# Altium project F407.PrjPCB
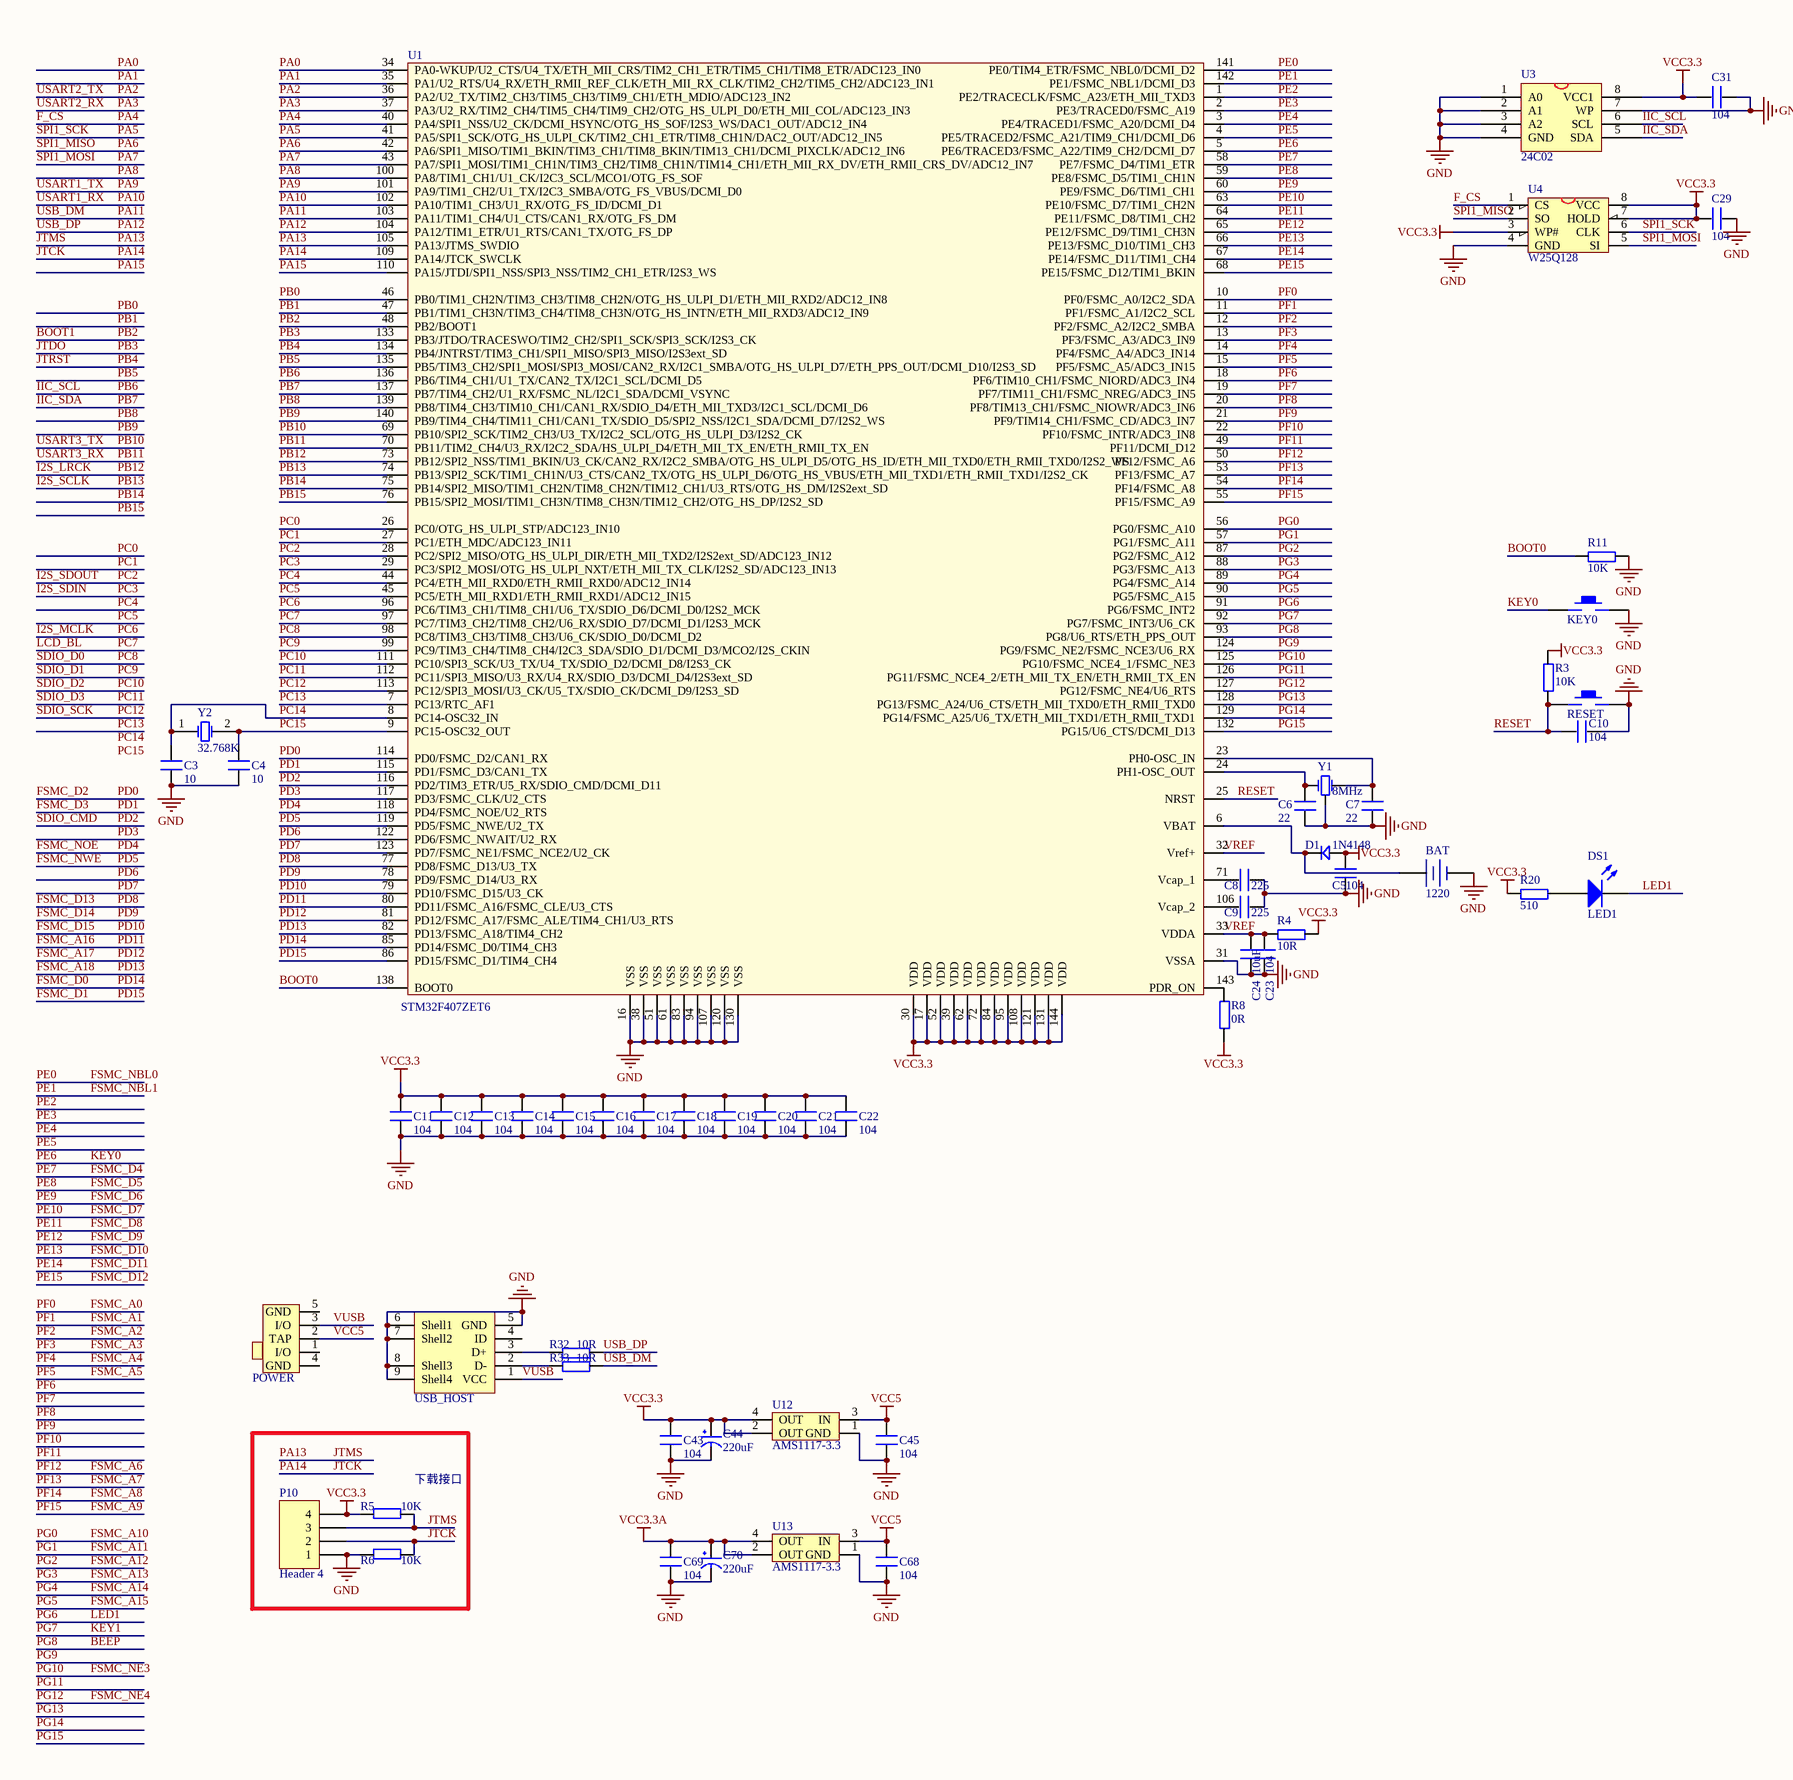
[diagram p0: F407.SchDoc, left]
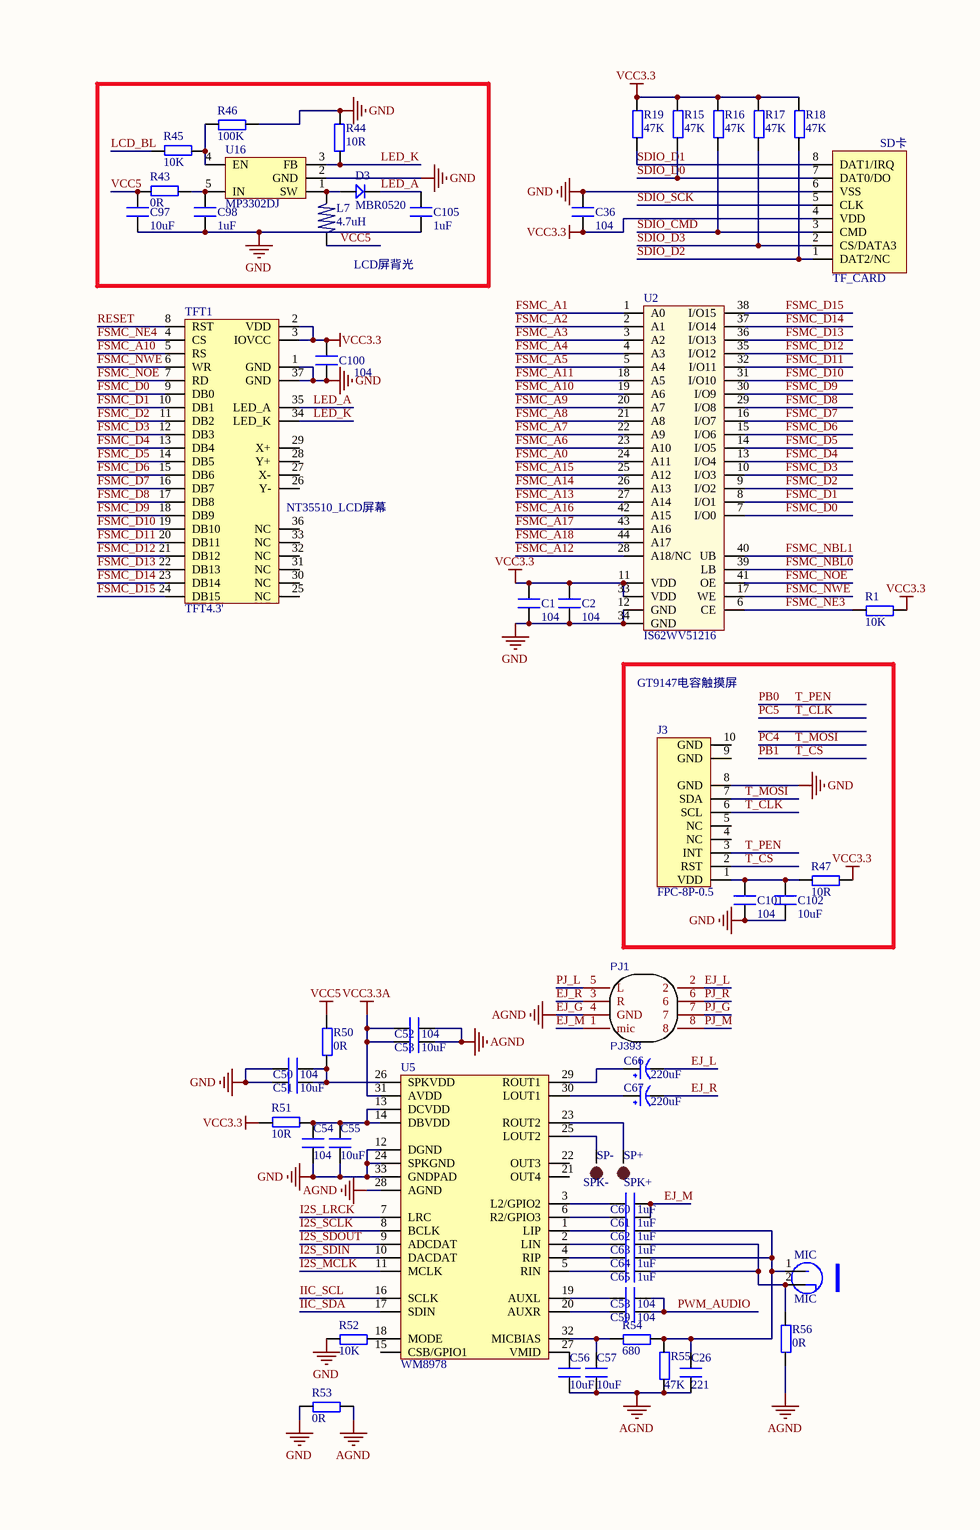
[diagram p1: F407.SchDoc, right]
1 sheet, 112 parts. Net scope: global (net labels, ports and power ports of the same name join across sheets).
Board file: F407.PcbDoc

## Sheet F407.SchDoc
size A2

### Parts
BAT  1220  [CR1220_B]
C1  104  [C 0603_M]
C2  104  [C 0603_M]
C3  10  [C 0603_M]
C4  10  [C 0603_M]
C5  104  [C 0603_M]
C6  22  [C 0603_M]
C7  22  [C 0603_M]
C8  225  [C 0603_M]
C9  225  [C 0603_M]
C10  104  [C 0603_M]
C11  104  [C 0603_M]
C12  104  [C 0603_M]
C13  104  [C 0603_M]
C14  104  [C 0603_M]
C15  104  [C 0603_M]
C16  104  [C 0603_M]
C17  104  [C 0603_M]
C18  104  [C 0603_M]
C19  104  [C 0603_M]
C20  104  [C 0603_M]
C21  104  [C 0603_M]
C22  104  [C 0603_M]
C23  104  [C 0603_M]
C24  10uF  [C 0603_M]
C26  221  [C 0603_M]
C29  104  [C 0603_M]
C31  104  [C 0603_M]
C36  104  [C 0603_M]
C43  104  [C 0603_M]
C44  220uF  [CT 6*6 - C]
C45  104  [C 0603_M]
C50  104  [C 0603_M]
C51  10uF  [C 0603_M]
C52  104  [C 0603_M]
C53  10uF  [C 0603_M]
C54  104  [C 0603_M]
C55  10uF  [C 0603_M]
C56  10uF  [C 0603_M]
C57  10uF  [C 0603_M]
C58  104  [C 0603_M]
C59  104  [C 0603_M]
C60  1uF  [C 0603_M]
C61  1uF  [C 0603_M]
C62  1uF  [C 0603_M]
C63  1uF  [C 0603_M]
C64  1uF  [C 0603_M]
C65  1uF  [C 0603_M]
C66  220uF  [CT 6*6 - C]
C67  220uF  [CT 6*6 - C]
C68  104  [C 0603_M]
C69  104  [C 0603_M]
C70  220uF  [CT 6*6 - C]
C97  10uF  [C 0603_M]
C98  1uF  [C 0603_M]
C100  104  [C 0603_M]
C101  104  [C 0603_M]
C102  10uF  [C 0603_M]
C105  1uF  [C 0603_M]
D1  1N4148  [DIODE_SOP]
D3  MBR0520  [SOD-123]
DS1  LED1  [LED 0603R]
J3  FPC-8P-0.5  [FPC-8P]
KEY0  KEY_M  [TSW SMD-3*6*2.5]  (value not drawn)
L7  4.7uH  [L_SOP4]
MIC  MIC  [MIC-6022]
P10  Header 4  [HDR2.54-LI-4P]
PJ1  PJ393  [PJ393]
POWER  BUTTON_DIP3  [MSK-12C01-07]  (value not drawn)
R1  10K  [R 0603_M]
R3  10K  [R 0603_M]
R4  10R  [R 0603_M]
R5  10K  [R 0603_M]
R6  10K  [R 0603_M]
R8  0R  [R 0603_M]
R11  10K  [R 0603_M]
R15  47K  [R 0603_M]
R16  47K  [R 0603_M]
R17  47K  [R 0603_M]
R18  47K  [R 0603_M]
R19  47K  [R 0603_M]
R20  510  [R 0603_M]
R32  10R  [R 0603_M]
R33  10R  [R 0603_M]
R43  0R  [R 0603_M]
R44  10R  [R 0603_M]
R45  10K  [R 0603_M]
R46  100K  [R 0603_M]
R47  10R  [R 0603_M]
R50  0R  [R 0603_M]
R51  10R  [R 0603_M]
R52  10K  [R 0603_M]
R53  0R  [R 0603_M]
R54  680  [R 0603_M]
R55  47K  [R 0603_M]
R56  0R  [R 0603_M]
RESET  KEY_M  [TSW SMD-3*6*2.5]  (value not drawn)
SP+  SPK+  [TP-1.5]
SP-  SPK-  [TP-1.5]
TF_CARD  SD-MICRO-TF  [SD-MICRO-TF]  (value not drawn)
TFT1  TFT4.3'  [TFT4.3']
U1  STM32F407ZET6  [LQFP144]
U2  IS62WV51216  [TSOP44]
U3  24C02  [SOP-8]
U4  W25Q128  [SOIC-8]
U5  WM8978  [qfn32]
U12  AMS1117-3.3  [AMS1117]
U13  AMS1117-3.3  [AMS1117]
U16  MP3302DJ  [SOT-23-5]
USB_HOST  J-MICRO-USB-5S  [USB-AB-5S]  (value not drawn)
Y1  8MHz  [Y-XTAL-3215-3P]
Y2  32.768K  [Y-XTAL-3215-2P]

### Blocks framed on the sheet
LCD屏背光: C97 C98 C105 D3 L7 R43-R46 U16
GT9147电容触摸屏: C101 C102 J3 R47
下载接口: P10 R5 R6

### Nets
EJ_G: C26.1 C52.2 C53.2 C56.1 C57.1 PJ1.4(GND) R53.2 R55.1 R56.1 U5.28(AGND)  [also labelled AGND]
GND: BAT.2(DC-) C1.1 C2.1 C3.1 C4.2 C5.1 C6.1 C7.1 C8.2 C9.2 C10.1 C11.1 C12.1 C13.1 C14.1 C15.1 C16.1 C17.1 C18.1 C19.1 C20.1 C21.1 C22.1 C23.1 C24.1 C29.2 C31.2 C36.2 C43.1 C44.2(GND) C45.1 C50.1 C51.1 C54.1 C55.1 C68.1 C69.1 C70.2(GND) C97.1 C98.1 C100.1 C101.1 C102.1 C105.2 J3.8(GND) KEY0.2 P10.1 R6.2 R11.2 R44.1 R46.2 R52.1 R53.1 RESET.2 TF_CARD.6(VSS) TFT1.1(GND) TFT1.37(GND) U1.16(VSS) U1.31(VSSA) U1.38(VSS) U1.51(VSS) U1.61(VSS) U1.83(VSS) U1.94(VSS) U1.107(VSS) U1.120(VSS) U1.130(VSS) U2.12(GND) U2.34(GND) U3.1(A0) U3.2(A1) U3.3(A2) U3.4(GND) U3.7(WP) U4.4(GND) U5.12(DGND) U5.24(SPKGND) U5.33(GNDPAD) U12.1(GND) U13.1(GND) U16.2(GND) USB_HOST.5(GND) USB_HOST.6(Shell1) USB_HOST.7(Shell2) USB_HOST.8(Shell3) USB_HOST.9(Shell4) Y1.2(GND)
VCC3.3: C1.2 C2.2 C5.2 C11.2 C12.2 C13.2 C14.2 C15.2 C16.2 C17.2 C18.2 C19.2 C20.2 C21.2 C22.2 C29.1 C31.1 C36.1 C43.2 C44.1(VCC) C100.2 D1.1 P10.4 R1.2 R3.2 R4.2 R5.2 R8.1 R15.2 R16.2 R17.2 R18.2 R19.2 R20.1 R47.2 R51.2 TF_CARD.4(VDD) TFT1.2(VDD) TFT1.3(IOVCC) U1.17(VDD) U1.30(VDD) U1.39(VDD) U1.52(VDD) U1.62(VDD) U1.72(VDD) U1.84(VDD) U1.95(VDD) U1.108(VDD) U1.121(VDD) U1.131(VDD) U1.144(VDD) U2.11(VDD) U2.33(VDD) U3.8(VCC1) U4.3(WP#) U4.7(HOLD) U4.8(VCC) U12.2(OUT) U12.4(OUT)
VCC3.3A: C52.1 C53.1 C69.2 C70.1(VCC) U5.31(AVDD) U13.2(OUT) U13.4(OUT)
VCC5: C45.2 C68.2 C97.2 L7.2 POWER.2(TAP) R43.2 R50.2 U12.3(IN) U13.3(IN)
BEEP: U1.93(PG8/U6_RTS/ETH_PPS_OUT)  [also labelled PG8]
BOOT0: R11.1 U1.138(BOOT0)
BOOT1: U1.48(PB2/BOOT1)  [also labelled PB2]
EJ_L: C66.2(GND) PJ1.2
EJ_M: C60.2 C61.2 PJ1.1(mic)
EJ_R: C67.2(GND) PJ1.3(R)
F_CS: U1.40(PA4/SPI1_NSS/U2_CK/DCMI_HSYNC/OTG_HS_SOF/I2S3_WS/DAC1_OUT/ADC12_IN4) U4.1(CS)  [also labelled PA4]
FSMC_A0: U1.10(PF0/FSMC_A0/I2C2_SDA) U2.24(A11)  [also labelled PF0]
FSMC_A1: U1.11(PF1/FSMC_A1/I2C2_SCL) U2.1(A0)  [also labelled PF1]
FSMC_A2: U1.12(PF2/FSMC_A2/I2C2_SMBA) U2.2(A1)  [also labelled PF2]
FSMC_A3: U1.13(PF3/FSMC_A3/ADC3_IN9) U2.3(A2)  [also labelled PF3]
FSMC_A4: U1.14(PF4/FSMC_A4/ADC3_IN14) U2.4(A3)  [also labelled PF4]
FSMC_A5: U1.15(PF5/FSMC_A5/ADC3_IN15) U2.5(A4)  [also labelled PF5]
FSMC_A6: U1.50(PF12/FSMC_A6) U2.23(A10)  [also labelled PF12]
FSMC_A7: U1.53(PF13/FSMC_A7) U2.22(A9)  [also labelled PF13]
FSMC_A8: U1.54(PF14/FSMC_A8) U2.21(A8)  [also labelled PF14]
FSMC_A9: U1.55(PF15/FSMC_A9) U2.20(A7)  [also labelled PF15]
FSMC_A10: TFT1.5(RS) U1.56(PG0/FSMC_A10) U2.19(A6)  [also labelled PG0]
FSMC_A11: U1.57(PG1/FSMC_A11) U2.18(A5)  [also labelled PG1]
FSMC_A12: U1.87(PG2/FSMC_A12) U2.28(A18/NC)  [also labelled PG2]
FSMC_A13: U1.88(PG3/FSMC_A13) U2.27(A14)  [also labelled PG3]
FSMC_A14: U1.89(PG4/FSMC_A14) U2.26(A13)  [also labelled PG4]
FSMC_A15: U1.90(PG5/FSMC_A15) U2.25(A12)  [also labelled PG5]
FSMC_A16: U1.80(PD11/FSMC_A16/FSMC_CLE/U3_CTS) U2.42(A15)  [also labelled PD11]
FSMC_A17: U1.81(PD12/FSMC_A17/FSMC_ALE/TIM4_CH1/U3_RTS) U2.43(A16)  [also labelled PD12]
FSMC_A18: U1.82(PD13/FSMC_A18/TIM4_CH2) U2.44(A17)  [also labelled PD13]
FSMC_D0: TFT1.9(DB0) U1.85(PD14/FSMC_D0/TIM4_CH3) U2.7(I/O0)  [also labelled PD14]
FSMC_D1: TFT1.10(DB1) U1.86(PD15/FSMC_D1/TIM4_CH4) U2.8(I/O1)  [also labelled PD15]
FSMC_D2: TFT1.11(DB2) U1.114(PD0/FSMC_D2/CAN1_RX) U2.9(I/O2)  [also labelled PD0]
FSMC_D3: TFT1.12(DB3) U1.115(PD1/FSMC_D3/CAN1_TX) U2.10(I/O3)  [also labelled PD1]
FSMC_D4: TFT1.13(DB4) U1.58(PE7/FSMC_D4/TIM1_ETR) U2.13(I/O4)  [also labelled PE7]
FSMC_D5: TFT1.14(DB5) U1.59(PE8/FSMC_D5/TIM1_CH1N) U2.14(I/O5)  [also labelled PE8]
FSMC_D6: TFT1.15(DB6) U1.60(PE9/FSMC_D6/TIM1_CH1) U2.15(I/O6)  [also labelled PE9]
FSMC_D7: TFT1.16(DB7) U1.63(PE10/FSMC_D7/TIM1_CH2N) U2.16(I/O7)  [also labelled PE10]
FSMC_D8: TFT1.17(DB8) U1.64(PE11/FSMC_D8/TIM1_CH2) U2.29(I/O8)  [also labelled PE11]
FSMC_D9: TFT1.18(DB9) U1.65(PE12/FSMC_D9/TIM1_CH3N) U2.30(I/O9)  [also labelled PE12]
FSMC_D10: TFT1.19(DB10) U1.66(PE13/FSMC_D10/TIM1_CH3) U2.31(I/O10)  [also labelled PE13]
FSMC_D11: TFT1.20(DB11) U1.67(PE14/FSMC_D11/TIM1_CH4) U2.32(I/O11)  [also labelled PE14]
FSMC_D12: TFT1.21(DB12) U1.68(PE15/FSMC_D12/TIM1_BKIN) U2.35(I/O12)  [also labelled PE15]
FSMC_D13: TFT1.22(DB13) U1.77(PD8/FSMC_D13/U3_TX) U2.36(I/O13)  [also labelled PD8]
FSMC_D14: TFT1.23(DB14) U1.78(PD9/FSMC_D14/U3_RX) U2.37(I/O14)  [also labelled PD9]
FSMC_D15: TFT1.24(DB15) U1.79(PD10/FSMC_D15/U3_CK) U2.38(I/O15)  [also labelled PD10]
FSMC_NBL0: U1.141(PE0/TIM4_ETR/FSMC_NBL0/DCMI_D2) U2.39(LB)  [also labelled PE0]
FSMC_NBL1: U1.142(PE1/FSMC_NBL1/DCMI_D3) U2.40(UB)  [also labelled PE1]
FSMC_NE3: R1.1 U1.125(PG10/FSMC_NCE4_1/FSMC_NE3) U2.6(CE)  [also labelled PG10]
FSMC_NE4: TFT1.4(CS) U1.127(PG12/FSMC_NE4/U6_RTS)  [also labelled PG12]
FSMC_NOE: TFT1.7(RD) U1.118(PD4/FSMC_NOE/U2_RTS) U2.41(OE)  [also labelled PD4]
FSMC_NWE: TFT1.6(WR) U1.119(PD5/FSMC_NWE/U2_TX) U2.17(WE)  [also labelled PD5]
I2S_LRCK: U1.73(PB12/SPI2_NSS/TIM1_BKIN/U3_CK/CAN2_RX/I2C2_SMBA/OTG_HS_ULPI_D5/OTG_HS_ID/ETH_MII_TXD0/ETH_RMII_TXD0/I2S2_WS) U5.7(LRC)  [also labelled PB12]
I2S_MCLK: U1.96(PC6/TIM3_CH1/TIM8_CH1/U6_TX/SDIO_D6/DCMI_D0/I2S2_MCK) U5.11(MCLK)  [also labelled PC6]
I2S_SCLK: U1.74(PB13/SPI2_SCK/TIM1_CH1N/U3_CTS/CAN2_TX/OTG_HS_ULPI_D6/OTG_HS_VBUS/ETH_MII_TXD1/ETH_RMII_TXD1/I2S2_CK) U5.8(BCLK)  [also labelled PB13]
I2S_SDIN: U1.29(PC3/SPI2_MOSI/OTG_HS_ULPI_NXT/ETH_MII_TX_CLK/I2S2_SD/ADC123_IN13) U5.10(DACDAT)  [also labelled PC3]
I2S_SDOUT: U1.28(PC2/SPI2_MISO/OTG_HS_ULPI_DIR/ETH_MII_TXD2/I2S2ext_SD/ADC123_IN12) U5.9(ADCDAT)  [also labelled PC2]
IIC_SCL: U1.136(PB6/TIM4_CH1/U1_TX/CAN2_TX/I2C1_SCL/DCMI_D5) U3.6(SCL) U5.16(SCLK)  [also labelled PB6]
IIC_SDA: U1.137(PB7/TIM4_CH2/U1_RX/FSMC_NL/I2C1_SDA/DCMI_VSYNC) U3.5(SDA) U5.17(SDIN)  [also labelled PB7]
JTCK: P10.2 R6.1 U1.109(PA14/JTCK_SWCLK)  [also labelled PA14]
JTDO: U1.133(PB3/JTDO/TRACESWO/TIM2_CH2/SPI1_SCK/SPI3_SCK/I2S3_CK)  [also labelled PB3]
JTMS: P10.3 R5.1 U1.105(PA13/JTMS_SWDIO)  [also labelled PA13]
JTRST: U1.134(PB4/JNTRST/TIM3_CH1/SPI1_MISO/SPI3_MISO/I2S3ext_SD)  [also labelled PB4]
KEY0: KEY0.1 U1.5(PE6/TRACED3/FSMC_A22/TIM9_CH2/DCMI_D7)  [also labelled PE6]
KEY1: U1.92(PG7/FSMC_INT3/U6_CK)  [also labelled PG7]
LCD_BL: R45.2 U1.97(PC7/TIM3_CH2/TIM8_CH2/U6_RX/SDIO_D7/DCMI_D1/I2S3_MCK)  [also labelled PC7]
LED1: DS1.2(K) U1.91(PG6/FSMC_INT2)  [also labelled PG6]
LED_A: C105.1 D3.2 TFT1.35(LED_A)
LED_K: R44.2 TFT1.34(LED_K) U16.3(FB)
PA0: U1.34(PA0-WKUP/U2_CTS/U4_TX/ETH_MII_CRS/TIM2_CH1_ETR/TIM5_CH1/TIM8_ETR/ADC123_IN0)
PA1: U1.35(PA1/U2_RTS/U4_RX/ETH_RMII_REF_CLK/ETH_MII_RX_CLK/TIM2_CH2/TIM5_CH2/ADC123_IN1)
PA2: U1.36(PA2/U2_TX/TIM2_CH3/TIM5_CH3/TIM9_CH1/ETH_MDIO/ADC123_IN2)  [also labelled USART2_TX]
PA3: U1.37(PA3/U2_RX/TIM2_CH4/TIM5_CH4/TIM9_CH2/OTG_HS_ULPI_D0/ETH_MII_COL/ADC123_IN3)  [also labelled USART2_RX]
PA5: U1.41(PA5/SPI1_SCK/OTG_HS_ULPI_CK/TIM2_CH1_ETR/TIM8_CH1N/DAC2_OUT/ADC12_IN5) U4.6(CLK)  [also labelled SPI1_SCK]
PA6: U1.42(PA6/SPI1_MISO/TIM1_BKIN/TIM3_CH1/TIM8_BKIN/TIM13_CH1/DCMI_PIXCLK/ADC12_IN6) U4.2(SO)  [also labelled SPI1_MISO]
PA7: U1.43(PA7/SPI1_MOSI/TIM1_CH1N/TIM3_CH2/TIM8_CH1N/TIM14_CH1/ETH_MII_RX_DV/ETH_RMII_CRS_DV/ADC12_IN7) U4.5(SI)  [also labelled SPI1_MOSI]
PA8: U1.100(PA8/TIM1_CH1/U1_CK/I2C3_SCL/MCO1/OTG_FS_SOF)
PA9: U1.101(PA9/TIM1_CH2/U1_TX/I2C3_SMBA/OTG_FS_VBUS/DCMI_D0)  [also labelled USART1_TX]
PA10: U1.102(PA10/TIM1_CH3/U1_RX/OTG_FS_ID/DCMI_D1)  [also labelled USART1_RX]
PA11: R33.2 U1.103(PA11/TIM1_CH4/U1_CTS/CAN1_RX/OTG_FS_DM)  [also labelled USB_DM]
PA12: R32.2 U1.104(PA12/TIM1_ETR/U1_RTS/CAN1_TX/OTG_FS_DP)  [also labelled USB_DP]
PA15: U1.110(PA15/JTDI/SPI1_NSS/SPI3_NSS/TIM2_CH1_ETR/I2S3_WS)
PB0: J3.3(INT) U1.46(PB0/TIM1_CH2N/TIM3_CH3/TIM8_CH2N/OTG_HS_ULPI_D1/ETH_MII_RXD2/ADC12_IN8)  [also labelled T_PEN]
PB1: J3.2(RST) U1.47(PB1/TIM1_CH3N/TIM3_CH4/TIM8_CH3N/OTG_HS_INTN/ETH_MII_RXD3/ADC12_IN9)  [also labelled T_CS]
PB5: U1.135(PB5/TIM3_CH2/SPI1_MOSI/SPI3_MOSI/CAN2_RX/I2C1_SMBA/OTG_HS_ULPI_D7/ETH_PPS_OUT/DCMI_D10/I2S3_SD)
PB8: U1.139(PB8/TIM4_CH3/TIM10_CH1/CAN1_RX/SDIO_D4/ETH_MII_TXD3/I2C1_SCL/DCMI_D6)
PB9: U1.140(PB9/TIM4_CH4/TIM11_CH1/CAN1_TX/SDIO_D5/SPI2_NSS/I2C1_SDA/DCMI_D7/I2S2_WS)
PB10: U1.69(PB10/SPI2_SCK/TIM2_CH3/U3_TX/I2C2_SCL/OTG_HS_ULPI_D3/I2S2_CK)  [also labelled USART3_TX]
PB11: U1.70(PB11/TIM2_CH4/U3_RX/I2C2_SDA/HS_ULPI_D4/ETH_MII_TX_EN/ETH_RMII_TX_EN)  [also labelled USART3_RX]
PB14: U1.75(PB14/SPI2_MISO/TIM1_CH2N/TIM8_CH2N/TIM12_CH1/U3_RTS/OTG_HS_DM/I2S2ext_SD)
PB15: U1.76(PB15/SPI2_MOSI/TIM1_CH3N/TIM8_CH3N/TIM12_CH2/OTG_HS_DP/I2S2_SD)
PC0: U1.26(PC0/OTG_HS_ULPI_STP/ADC123_IN10)
PC1: U1.27(PC1/ETH_MDC/ADC123_IN11)
PC4: J3.7(SDA) U1.44(PC4/ETH_MII_RXD0/ETH_RMII_RXD0/ADC12_IN14)  [also labelled T_MOSI]
PC5: J3.6(SCL) U1.45(PC5/ETH_MII_RXD1/ETH_RMII_RXD1/ADC12_IN15)  [also labelled T_CLK]
PC8: R15.1 TF_CARD.7(DAT0/DO) U1.98(PC8/TIM3_CH3/TIM8_CH3/U6_CK/SDIO_D0/DCMI_D2)  [also labelled SDIO_D0]
PC9: R19.1 TF_CARD.8(DAT1/IRQ) U1.99(PC9/TIM3_CH4/TIM8_CH4/I2C3_SDA/SDIO_D1/DCMI_D3/MCO2/I2S_CKIN)  [also labelled SDIO_D1]
PC10: R18.1 TF_CARD.1(DAT2/NC) U1.111(PC10/SPI3_SCK/U3_TX/U4_TX/SDIO_D2/DCMI_D8/I2S3_CK)  [also labelled SDIO_D2]
PC11: R17.1 TF_CARD.2(CS/DATA3) U1.112(PC11/SPI3_MISO/U3_RX/U4_RX/SDIO_D3/DCMI_D4/I2S3ext_SD)  [also labelled SDIO_D3]
PC12: TF_CARD.5(CLK) U1.113(PC12/SPI3_MOSI/U3_CK/U5_TX/SDIO_CK/DCMI_D9/I2S3_SD)  [also labelled SDIO_SCK]
PC13: U1.7(PC13/RTC_AF1)
PC14: C3.2 U1.8(PC14-OSC32_IN) Y2.1(OSC1)
PC15: C4.1 U1.9(PC15-OSC32_OUT) Y2.2(OSC2)
PD2: R16.1 TF_CARD.3(CMD) U1.116(PD2/TIM3_ETR/U5_RX/SDIO_CMD/DCMI_D11)  [also labelled SDIO_CMD]
PD3: U1.117(PD3/FSMC_CLK/U2_CTS)
PD6: U1.122(PD6/FSMC_NWAIT/U2_RX)
PD7: U1.123(PD7/FSMC_NE1/FSMC_NCE2/U2_CK)
PE2: U1.1(PE2/TRACECLK/FSMC_A23/ETH_MII_TXD3)
PE3: U1.2(PE3/TRACED0/FSMC_A19)
PE4: U1.3(PE4/TRACED1/FSMC_A20/DCMI_D4)
PE5: U1.4(PE5/TRACED2/FSMC_A21/TIM9_CH1/DCMI_D6)
PF6: U1.18(PF6/TIM10_CH1/FSMC_NIORD/ADC3_IN4)
PF7: U1.19(PF7/TIM11_CH1/FSMC_NREG/ADC3_IN5)
PF8: U1.20(PF8/TIM13_CH1/FSMC_NIOWR/ADC3_IN6)
PF9: U1.21(PF9/TIM14_CH1/FSMC_CD/ADC3_IN7)
PF10: U1.22(PF10/FSMC_INTR/ADC3_IN8)
PF11: U1.49(PF11/DCMI_D12)
PG9: U1.124(PG9/FSMC_NE2/FSMC_NCE3/U6_RX)
PG11: U1.126(PG11/FSMC_NCE4_2/ETH_MII_TX_EN/ETH_RMII_TX_EN)
PG13: U1.128(PG13/FSMC_A24/U6_CTS/ETH_MII_TXD0/ETH_RMII_TXD0)
PG14: U1.129(PG14/FSMC_A25/U6_TX/ETH_MII_TXD1/ETH_RMII_TXD1)
PG15: U1.132(PG15/U6_CTS/DCMI_D13)
PJ_G: PJ1.7
PJ_L: PJ1.5(L)
PJ_M: PJ1.8
PJ_R: PJ1.6
PWM_AUDIO: C58.2 C59.2
RESET: C10.2 R3.1 RESET.1 TFT1.8(RST) U1.25(NRST)
VREF: C23.2 C24.2 R4.1 U1.32(Vref+) U1.33(VDDA)
VUSB: POWER.3(I/O) USB_HOST.1(VCC)
NetBAT_1: BAT.1(DC+) D1.2 U1.6(VBAT)
NetC6_2: C6.2 U1.24(PH1-OSC_OUT) Y1.1(OSC1)
NetC7_2: C7.2 U1.23(PH0-OSC_IN) Y1.3(OSC2)
NetC8_1: C8.1 U1.71(Vcap_1)
NetC9_1: C9.1 U1.106(Vcap_2)
NetC26_2: C26.2 C62.2 C64.2 MIC.1(VCC) R54.2 R55.2
NetC50_2: C50.2 C51.2 R50.1 U5.26(SPKVDD)
NetC54_2: C54.2 C55.2 R51.1 U5.13(DCVDD) U5.14(DBVDD)
NetC56_2: C56.2 U5.27(VMID)
NetC57_2: C57.2 R54.1 U5.32(MICBIAS)
NetC58_1: C58.1 U5.19(AUXL)
NetC59_1: C59.1 U5.20(AUXR)
NetC60_1: C60.1 U5.3(L2/GPIO2)
NetC61_1: C61.1 U5.6(R2/GPIO3)
NetC62_1: C62.1 U5.1(LIP)
NetC63_1: C63.1 U5.2(LIN)
NetC63_2: C63.2 C65.2 MIC.2(GND) R56.2
NetC64_1: C64.1 U5.4(RIP)
NetC65_1: C65.1 U5.5(RIN)
NetC66_1: C66.1(VCC) U5.29(ROUT1)
NetC67_1: C67.1(VCC) U5.30(LOUT1)
NetC98_2: C98.2 R43.1 U16.5(IN)
NetC101_2: C101.2 C102.2 J3.1(VDD) R47.1
NetD3_1: D3.1 L7.1 U16.1(SW)
NetDS1_1: DS1.1(A) R20.2
NetR8_2: R8.2 U1.143(PDR_ON)
NetR32_1: R32.1 USB_HOST.3(D+)
NetR33_1: R33.1 USB_HOST.2(D-)
NetR45_1: R45.1 R46.1 U16.4(EN)
NetR52_2: R52.2 U5.18(MODE)
NetSP+_1: SP+.1 U5.23(ROUT2)
NetSP-_1: SP-.1 U5.25(LOUT2)

Not connected (* = marked no-connect by the designer): J3 4(NC) 5(NC) 9(GND) 10(GND); POWER 1(I/O) 4(GND) 5(GND); TFT1 25(NC) 26(Y-) 27(X-) 28(Y+) 29(X+) 30(NC) 31(NC) 32(NC) 33(NC) 36(NC); U5 15(CSB/GPIO1) 21(OUT4) 22(OUT3); USB_HOST 4(ID)

### Notes on the sheet
- (near TF_CARD) SD卡
- (near TFT1) NT35510_LCD屏幕
- Labels drawn without touching a wire or pin: PC14, PC15

### Library data of the parts
BAT = CR-3V: 微型电池; 版权归属: 源创客; BOM名称: 微型电池; 学习资源: www.ooocke.com
C1-C24 C26 C29 C31 C36 C43 C45 C50-C65 C68 C69 C97 C98 C100-C102 C105 = C
C44 C66 C67 C70 = CAP
D1 = D
D3 = D: 1N4148
DS1 = LED2: Typical RED, GREEN, YELLOW, AMBER GaAs LED; Published: 8-Jun-2000; LatestRevisionDate: 17-Jul-2002; LatestRevisionNote: Re-released for DXP Platform.; PackageDocument: Feb-2002; PackageReference: 3.2X1.6X1.1; Publisher: Altium Limited
J3 = FPC-8: FPC-8P-0.5mm
L7 = L
P10 = Header 4: Header, 4-Pin; LatestRevisionDate: 17-Jul-2002; LatestRevisionNote: Re-released for DXP Platform.; Publisher: Altium Limited
PJ1 = PJ393: Contributor: infinite_possibilities; BOM_Manufacturer Part: ?; spicePre: U
POWER = BUTTON_DIP3: 拨动开关SS-12F44
R1 R3-R6 R8 R11 R15-R20 R32 R33 R43-R47 R50-R56 = R
SP+ SP- = TEST-POINT: 测试点
TF_CARD = SD-MICRO-TF: SD,MICRO,TF
TFT1 = TFT4.3‘: 4.3寸,电容/电阻触摸,分辨率:480*800
U2 = IS61LV51216
U3 = 24C256
U4 = W25X16: W25X16;SST25VF016;MX25L1605
U5 = WM8978: 24bit ADC&DAC
U12 U13 = AMS1117
U16 = MP3302: LCD背光IC
USB_HOST = J-MICRO-USB-5S: Micro USB 5.9有柱脚长1.25加长针
Y1 = Y-3215-8M: XTAL,3215,8MHz
Y2 = XTAL: Crystal Oscillator; Published: 8-Jun-2000; LatestRevisionDate: 17-Jul-2002; LatestRevisionNote: Re-released for DXP Platform.; Publisher: Altium Limited